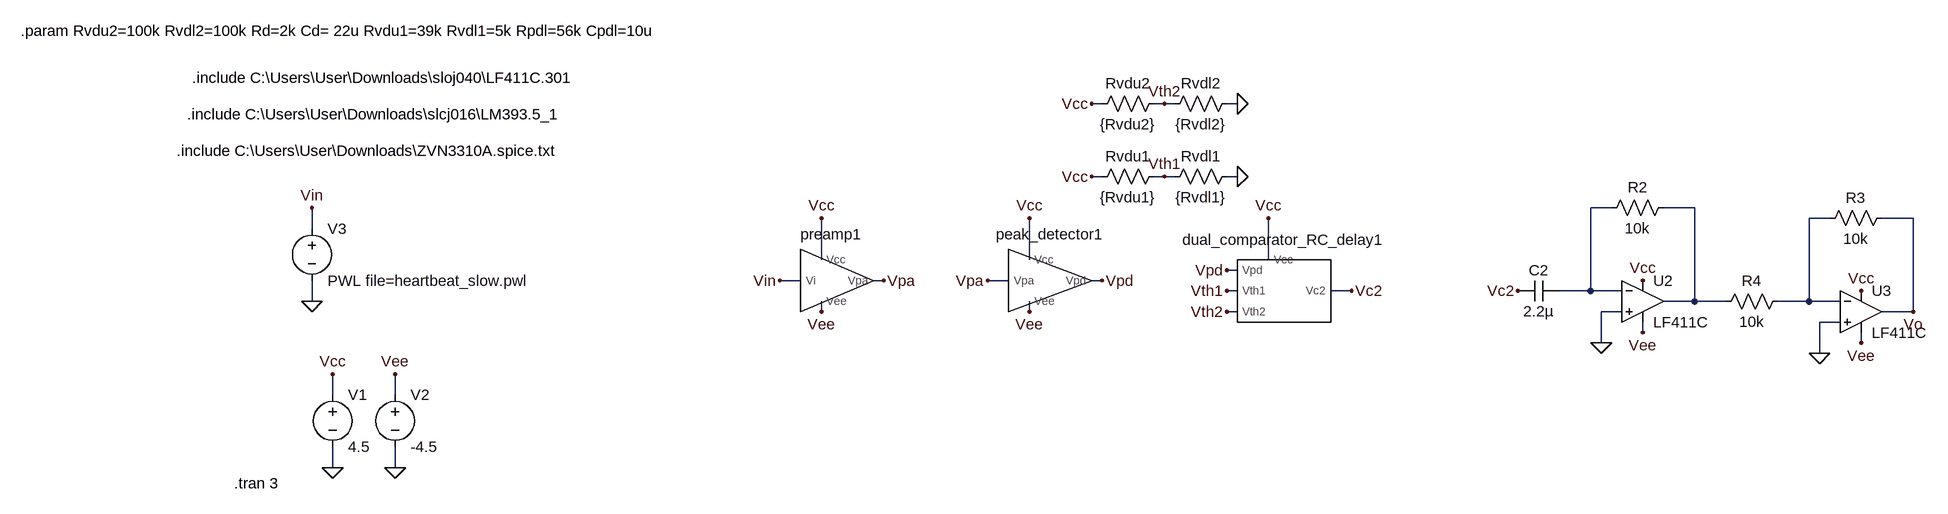
[diagram p0: schematic dVdt.asc]
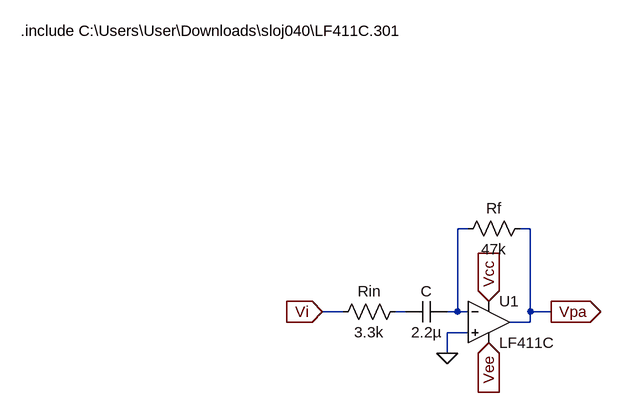
[diagram p1: sub-circuit preamp.asc]
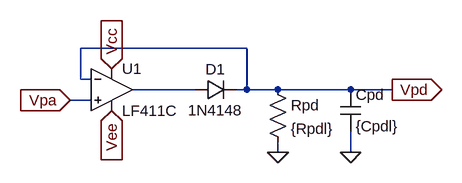
[diagram p2: sub-circuit peakdetector_lab7.asc]
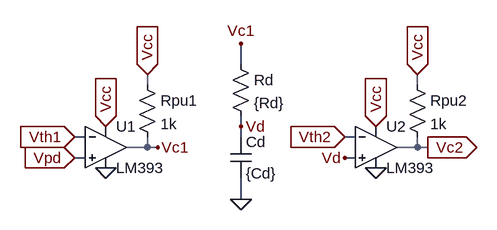
[diagram p3: sub-circuit delay.asc]
dVdt.asc, the LTspice schematic file:
Version 4
SHEET 1 1544 680
WIRE -96 -96 -112 -96
WIRE 0 -96 -16 -96
WIRE 16 -96 0 -96
WIRE 112 -96 96 -96
WIRE -96 16 -112 16
WIRE 0 16 -16 16
WIRE 16 16 0 16
WIRE 112 16 96 16
WIRE 688 64 656 64
WIRE 816 64 768 64
WIRE 1024 80 992 80
WIRE 1152 80 1104 80
WIRE -1312 96 -1312 64
WIRE -528 144 -528 80
WIRE -208 144 -208 80
WIRE 160 144 160 80
WIRE 112 160 96 160
WIRE -560 176 -592 176
WIRE -432 176 -448 176
WIRE -240 176 -272 176
WIRE -96 176 -112 176
WIRE 112 192 96 192
WIRE 288 192 256 192
WIRE 656 192 656 64
WIRE 656 192 608 192
WIRE 704 192 656 192
WIRE -1312 208 -1312 176
WIRE 816 208 816 64
WIRE 816 208 768 208
WIRE 864 208 816 208
WIRE 992 208 992 80
WIRE 992 208 944 208
WIRE 1040 208 992 208
WIRE -528 224 -528 208
WIRE -208 224 -208 208
WIRE 112 224 96 224
WIRE 704 224 672 224
WIRE 1152 224 1152 80
WIRE 1152 224 1104 224
WIRE 1040 240 1008 240
WIRE 736 256 736 240
WIRE 672 272 672 224
WIRE 1072 272 1072 256
WIRE 1008 288 1008 240
WIRE -1280 352 -1280 320
WIRE -1184 352 -1184 320
WIRE -1280 464 -1280 432
WIRE -1184 464 -1184 432
FLAG 112 16 0
FLAG -112 16 Vcc
FLAG 0 16 Vth1
FLAG 112 -96 0
FLAG -112 -96 Vcc
FLAG 0 -96 Vth2
FLAG -528 224 Vee
FLAG -432 176 Vpa
FLAG -592 176 Vin
FLAG -208 224 Vee
FLAG -272 176 Vpa
FLAG -528 80 Vcc
FLAG -208 80 Vcc
FLAG -96 176 Vpd
FLAG 96 160 Vpd
FLAG 96 192 Vth1
FLAG 96 224 Vth2
FLAG 160 80 Vcc
FLAG 288 192 Vc2
FLAG -1280 464 0
FLAG -1184 464 0
FLAG -1280 320 Vcc
FLAG -1184 320 Vee
FLAG -1312 208 0
FLAG -1312 64 Vin
FLAG 672 272 0
FLAG 544 192 Vc2
FLAG 736 176 Vcc
FLAG 736 256 Vee
FLAG 1008 288 0
FLAG 1072 192 Vcc
FLAG 1072 272 Vee
FLAG 1152 224 Vo
SYMBOL res 0 32 R270
WINDOW 0 32 56 VTop 2
WINDOW 3 0 56 VBottom 2
SYMATTR InstName Rvdl1
SYMATTR Value {Rvdl1}
SYMBOL res -112 32 R270
WINDOW 0 32 56 VTop 2
WINDOW 3 0 56 VBottom 2
SYMATTR InstName Rvdu1
SYMATTR Value {Rvdu1}
SYMBOL res 0 -80 R270
WINDOW 0 32 56 VTop 2
WINDOW 3 0 56 VBottom 2
SYMATTR InstName Rvdl2
SYMATTR Value {Rvdl2}
SYMBOL res -112 -80 R270
WINDOW 0 32 56 VTop 2
WINDOW 3 0 56 VBottom 2
SYMATTR InstName Rvdu2
SYMATTR Value {Rvdu2}
SYMBOL preamp -512 176 R0
SYMATTR InstName preamp1
SYMBOL peakdetector_lab7 -176 176 R0
SYMATTR InstName peak_detector1
SYMBOL delay 176 176 R0
SYMATTR InstName dual_comparator_RC_delay1
SYMBOL voltage -1280 336 R0
WINDOW 123 0 0 Left 0
WINDOW 39 0 0 Left 0
SYMATTR InstName V1
SYMATTR Value 4.5
SYMBOL voltage -1184 336 R0
WINDOW 123 0 0 Left 0
WINDOW 39 0 0 Left 0
SYMATTR InstName V2
SYMATTR Value -4.5
SYMBOL voltage -1312 80 R0
WINDOW 123 0 0 Left 0
WINDOW 39 0 0 Left 0
SYMATTR InstName V3
SYMATTR Value PWL file=heartbeat_slow.pwl
SYMBOL OpAmps\\opamp2 736 144 R0
SYMATTR InstName U2
SYMATTR Value LF411C
SYMBOL res 784 48 R90
WINDOW 0 0 56 VBottom 2
WINDOW 3 32 56 VTop 2
SYMATTR InstName R2
SYMATTR Value 10k
SYMBOL cap 608 176 R90
WINDOW 0 0 32 VBottom 2
WINDOW 3 32 32 VTop 2
SYMATTR InstName C2
SYMATTR Value 2.2µ
SYMBOL OpAmps\\opamp2 1072 160 R0
SYMATTR InstName U3
SYMATTR Value LF411C
SYMBOL res 1120 64 R90
WINDOW 0 0 56 VBottom 2
WINDOW 3 32 56 VTop 2
SYMATTR InstName R3
SYMATTR Value 10k
SYMBOL res 960 192 R90
WINDOW 0 0 56 VBottom 2
WINDOW 3 32 56 VTop 2
SYMATTR InstName R4
SYMATTR Value 10k
TEXT -1520 -24 Left 2 !.include C:\\Users\\User\\Downloads\\ZVN3310A.spice.txt
TEXT -1504 -80 Left 2 !.include C:\\Users\\User\\Downloads\\slcj016\\LM393.5_1
TEXT -1760 -208 Left 2 !.param Rvdu2=100k Rvdl2=100k Rd=2k Cd= 22u Rvdu1=39k Rvdl1=5k Rpdl=56k Cpdl=10u
TEXT -1496 -136 Left 2 !.include C:\\Users\\User\\Downloads\\sloj040\\LF411C.301
TEXT -1432 488 Left 2 !.tran 3

preamp.asc, the sub-circuit schematic file:
Version 4
SHEET 1 1208 680
WIRE 592 32 576 32
WIRE 688 32 672 32
WIRE 400 160 368 160
WIRE 496 160 480 160
WIRE 576 160 576 32
WIRE 576 160 560 160
WIRE 592 160 576 160
WIRE 688 160 688 32
WIRE 720 160 688 160
WIRE 688 176 688 160
WIRE 688 176 656 176
WIRE 592 192 560 192
WIRE 560 224 560 192
FLAG 560 224 0
FLAG 368 160 Vi
IOPIN 368 160 In
FLAG 624 144 Vcc
IOPIN 624 144 In
FLAG 624 208 Vee
IOPIN 624 208 In
FLAG 720 160 Vpa
IOPIN 720 160 Out
SYMBOL res 496 144 R90
WINDOW 0 0 56 VBottom 2
WINDOW 3 32 56 VTop 2
SYMATTR InstName Rin
SYMATTR Value 3.3k
SYMBOL cap 560 144 R90
WINDOW 0 0 32 VBottom 2
WINDOW 3 32 32 VTop 2
SYMATTR InstName C
SYMATTR Value 2.2µ
SYMBOL OpAmps\\opamp2 624 112 R0
SYMATTR InstName U1
SYMATTR Value LF411C
SYMBOL res 688 16 R90
WINDOW 0 0 56 VBottom 2
WINDOW 3 32 56 VTop 2
SYMATTR InstName Rf
SYMATTR Value 47k
TEXT -96 -272 Left 2 !.include C:\\Users\\User\\Downloads\\sloj040\\LF411C.301

peakdetector_lab7.asc, the sub-circuit schematic file:
Version 4
SHEET 1 880 680
WIRE 240 112 -16 112
WIRE -16 160 -16 112
WIRE 0 160 -16 160
WIRE 160 176 64 176
WIRE 240 176 240 112
WIRE 240 176 224 176
WIRE 288 176 240 176
WIRE 400 176 288 176
WIRE 464 176 400 176
WIRE 0 192 -32 192
WIRE 288 272 288 256
WIRE 400 272 400 240
FLAG -32 192 Vpa
IOPIN -32 192 In
FLAG 32 144 Vcc
IOPIN 32 144 In
FLAG 32 208 Vee
IOPIN 32 208 In
FLAG 464 176 Vpd
IOPIN 464 176 Out
FLAG 288 272 0
FLAG 400 272 0
SYMBOL diode 160 192 R270
WINDOW 0 32 32 VTop 2
WINDOW 3 0 32 VBottom 2
SYMATTR InstName D1
SYMATTR Value 1N4148
SYMBOL res 272 160 R0
SYMATTR InstName Rpd
SYMATTR Value {Rpdl}
SYMBOL cap 384 176 R0
SYMATTR InstName Cpd
SYMATTR Value {Cpdl}
SYMBOL OpAmps\\opamp2 32 112 R0
SYMATTR InstName U1
SYMATTR Value LF411C

delay.asc, the sub-circuit schematic file:
Version 4
SHEET 1 880 680
WIRE 192 96 192 64
WIRE 48 128 48 112
WIRE 464 128 464 112
WIRE 192 192 192 176
WIRE -48 208 -64 208
WIRE 192 208 192 192
WIRE 368 208 352 208
WIRE 48 224 48 208
WIRE 48 224 16 224
WIRE 64 224 48 224
WIRE 464 224 464 208
WIRE 464 224 432 224
WIRE 480 224 464 224
WIRE -48 240 -64 240
WIRE 368 240 352 240
WIRE 192 304 192 272
FLAG -16 256 0
FLAG -16 192 Vcc
IOPIN -16 192 In
FLAG -64 208 Vth1
IOPIN -64 208 In
FLAG -64 240 Vpd
IOPIN -64 240 In
FLAG 64 224 Vc1
FLAG 48 112 Vcc
IOPIN 48 112 In
FLAG 400 256 0
FLAG 400 192 Vcc
IOPIN 400 192 In
FLAG 352 240 Vd
FLAG 464 112 Vcc
IOPIN 464 112 In
FLAG 192 304 0
FLAG 192 64 Vc1
FLAG 192 192 Vd
FLAG 352 208 Vth2
IOPIN 352 208 In
FLAG 480 224 Vc2
IOPIN 480 224 Out
SYMBOL OpAmps\\opamp2 -16 160 R0
SYMATTR InstName U1
SYMATTR Value LM393
SYMBOL res 32 112 R0
SYMATTR InstName Rpu1
SYMATTR Value 1k
SYMBOL OpAmps\\opamp2 400 160 R0
SYMATTR InstName U2
SYMATTR Value LM393
SYMBOL res 448 112 R0
SYMATTR InstName Rpu2
SYMATTR Value 1k
SYMBOL res 176 80 R0
SYMATTR InstName Rd
SYMATTR Value {Rd}
SYMBOL cap 176 208 R0
SYMATTR InstName Cd
SYMATTR Value {Cd}

The netlist it stands for:
* dVdt.asc
Rvdl1 Vth1 0 {Rvdl1}
Rvdu1 Vcc Vth1 {Rvdu1}
Rvdl2 Vth2 0 {Rvdl2}
Rvdu2 Vcc Vth2 {Rvdu2}
Xpreamp1 Vcc Vee Vin Vpa preamp
Xpeak_detector1 Vcc Vee Vpa Vpd peakdetector_lab7
Xdual_comparator_RC_delay1 Vcc Vpd Vth1 Vth2 Vc2 delay
V1 Vcc 0 4.5
V2 Vee 0 -4.5
V3 Vin 0 PWL file=heartbeat_slow.pwl
XU2 0 N001 Vcc Vee N002 LF411C  ; pins In+ In- V+ V- OUT
R2 N002 N001 10k
C2 N001 Vc2 2.2µ
XU3 0 N003 Vcc Vee Vo LF411C  ; pins In+ In- V+ V- OUT
R3 Vo N003 10k
R4 N003 N002 10k

* block symbol definitions
.subckt preamp Vcc Vee Vi Vpa
Rin N002 Vi 3.3k
C N001 N002 2.2µ
XU1 0 N001 Vcc Vee Vpa LF411C  ; pins In+ In- V+ V- OUT
Rf Vpa N001 47k
.include C:\Users\User\Downloads\sloj040\LF411C.301
.ends preamp

.subckt peakdetector_lab7 Vcc Vee Vpa Vpd
D1 N001 Vpd 1N4148
Rpd Vpd 0 {Rpdl}
Cpd Vpd 0 {Cpdl}
XU1 Vpa Vpd Vcc Vee N001 LF411C  ; pins In+ In- V+ V- OUT
.ends peakdetector_lab7

.subckt delay Vcc Vpd Vth1 Vth2 Vc2
XU1 Vpd Vth1 Vcc 0 Vc1 LM393  ; pins In+ In- V+ V- OUT
Rpu1 Vcc Vc1 1k
XU2 Vd Vth2 Vcc 0 Vc2 LM393  ; pins In+ In- V+ V- OUT
Rpu2 Vcc Vc2 1k
Rd Vc1 Vd {Rd}
Cd Vd 0 {Cd}
.ends delay

.model D D
.lib standard.dio
.include C:\Users\User\Downloads\ZVN3310A.spice.txt
.include C:\Users\User\Downloads\slcj016\LM393.5_1
.param Rvdu2=100k Rvdl2=100k Rd=2k Cd= 22u Rvdu1=39k Rvdl1=5k Rpdl=56k Cpdl=10u
.include C:\Users\User\Downloads\sloj040\LF411C.301
.tran 3
.backanno
.end